# Altium schematic sheet Ethernet.SchDoc: Ethernet
size A4; DocumentNumber: MB1246; Revision: B.1; SheetNumber: 7; SheetTotal: 17; Project: STM32H7xxI-EVAL
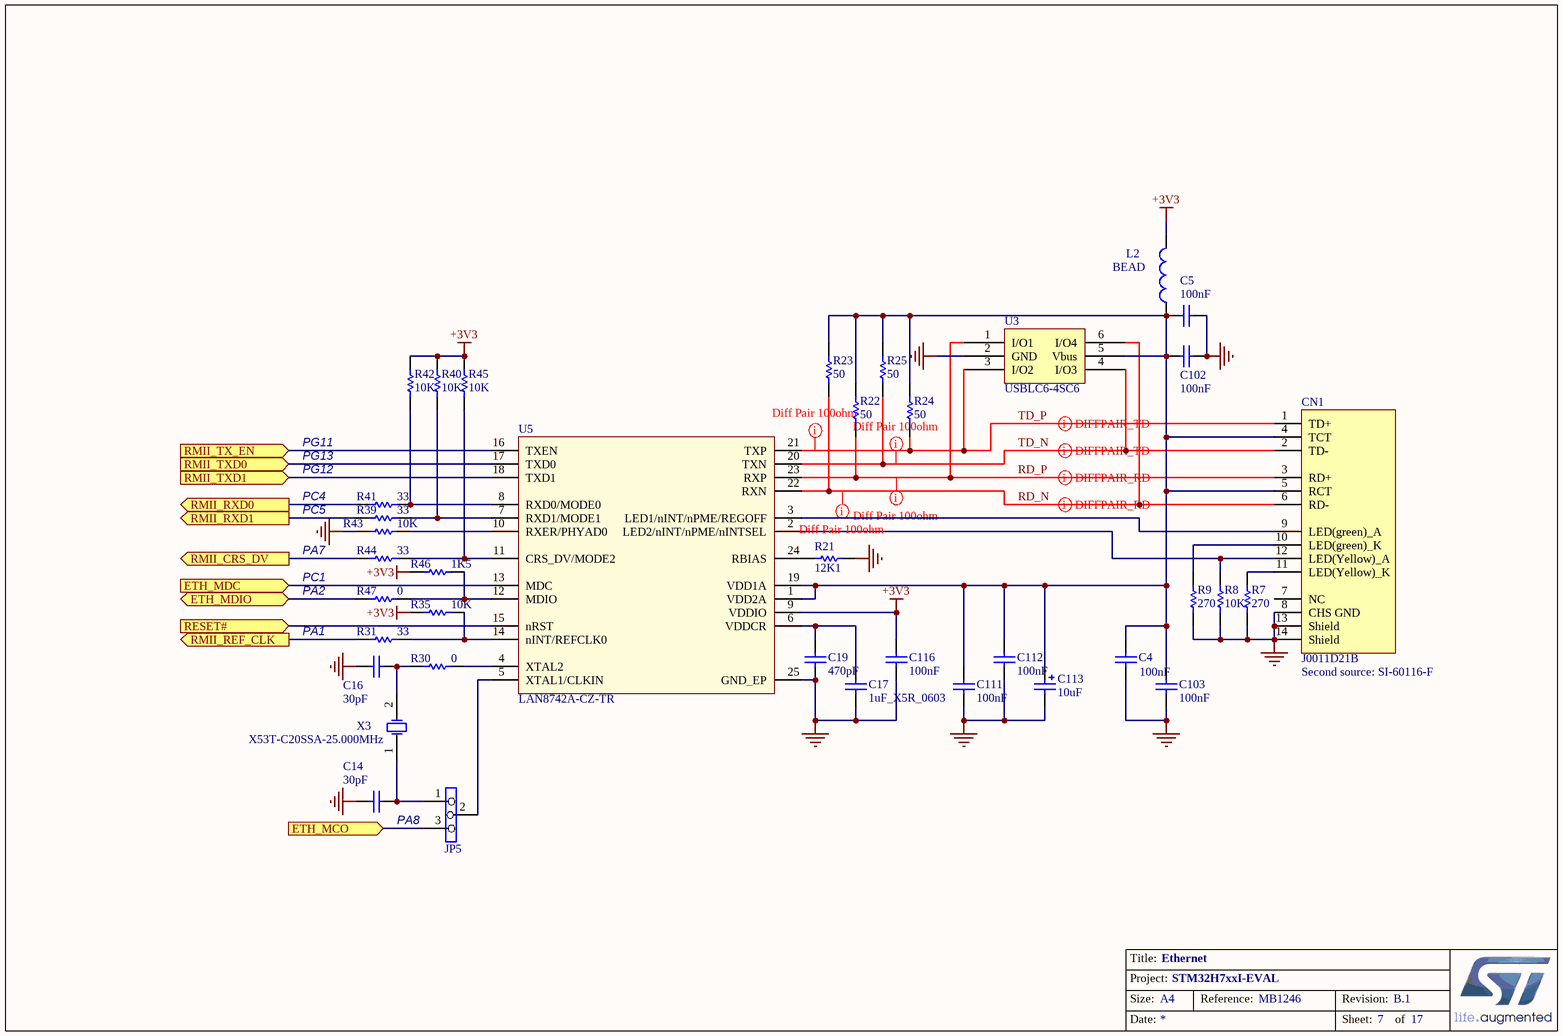
[diagram p0: Ethernet.SchDoc]

## Parts
C4  100nF  [0603C]
C5  100nF  [0603C]
C14  30pF  [0603C]
C16  30pF  [0603C]
C17  1uF_X5R_0603  [0603C]
C19  470pF  [0603C]
C102  100nF  [0603C]
C103  100nF  [0603C]
C111  100nF  [0603C]
C112  100nF  [0603C]
C113  10uF  [TAN-A]
C116  100nF  [0603C]
CN1  J0011D21B  [RJ45_J0011D01BNL]
JP5  (no value)  [SIP3]
L2  BEAD  [0603L]
R7  270  [0603R]
R8  10K  [0603R]
R9  270  [0603R]
R21  12K1  [0603R]
R22  50  [0603R]
R23  50  [0603R]
R24  50  [0603R]
R25  50  [0603R]
R30  0  [0603R]
R31  33  [0603R]
R35  10K  [0603R]
R39  33  [0603R]
R40  10K  [0603R]
R41  33  [0603R]
R42  10K  [0603R]
R43  10K  [0603R]
R44  33  [0603R]
R45  10K  [0603R]
R46  1K5  [0603R]
R47  0  [0603R]
U3  USBLC6-4SC6  [SOT23-6]
U5  LAN8742A-CZ-TR  [QFN24_0R5_4X4]
X3  X53T-C20SSA-25.000MHz  [XTAL_2SM_5X3R2]

## Ports
ETH_MCO (in), ETH_MDC (in), ETH_MDIO (bidir), RESET# (in), RMII_CRS_DV (out), RMII_REF_CLK (out), RMII_RXD0 (out), RMII_RXD1 (out), RMII_TX_EN (in), RMII_TXD0 (in), RMII_TXD1 (in)

## Nets
+3V3: C116.2 L2.2 R35.1 R40.1 R42.1 R45.1 R46.2 U5.9(VDDIO)
GND: C4.1 C5.1 C14.2 C16.2 C17.2 C19.1 C102.1 C103.1 C111.1 C112.1 C113.2 C116.1 CN1.8(CHS_GND) CN1.13(Shield) CN1.14(Shield) R7.2 R8.2 R9.2 R21.2 R43.2 U3.2(GND) U5.25(GND_EP)
ETH_MCO: JP5.3 ; port ETH_MCO
ETH_MDC: U5.13(MDC) ; port ETH_MDC
ETH_MDIO: R47.2 ; port ETH_MDIO
RD_N: CN1.6(RD-) R23.1 U3.6(I/O4) U5.22(RXN)
RD_P: CN1.3(RD+) R22.1 U3.1(I/O1) U5.23(RXP)
RESET#: U5.15(nRST) ; port RESET#
RMII_CRS_DV: R44.2 ; port RMII_CRS_DV
RMII_REF_CLK: R31.2 ; port RMII_REF_CLK
RMII_RXD0: R41.2 ; port RMII_RXD0
RMII_RXD1: R39.2 ; port RMII_RXD1
RMII_TX_EN: U5.16(TXEN) ; port RMII_TX_EN
RMII_TXD0: U5.17(TXD0) ; port RMII_TXD0
RMII_TXD1: U5.18(TXD1) ; port RMII_TXD1
TD_N: CN1.2(TD-) R25.1 U3.4(I/O3) U5.20(TXN)
TD_P: CN1.1(TD+) R24.1 U3.3(I/O2) U5.21(TXP)
NetC4_2: C4.2 C5.2 C102.2 C103.2 C111.2 C112.2 C113.1 CN1.4(TCT) CN1.5(RCT) L2.1 R22.2 R23.2 R24.2 R25.2 U3.5(Vbus) U5.1(VDD2A) U5.19(VDD1A)
NetC14_1: C14.1 JP5.1 X3.1(OSC1)
NetC16_1: C16.1 R30.2 X3.2(OSC2)
NetC17_1: C17.1 C19.2 U5.6(VDDCR)
NetCN1_9: CN1.9(LED(green)_A) U5.3(LED1/nINT/nPME/REGOFF)
NetCN1_10: CN1.10(LED(green)_K) R9.1
NetCN1_11: CN1.11(LED(Yellow)_K) R7.1
NetCN1_12: CN1.12(LED(Yellow)_A) R8.1 U5.2(LED2/nINT/nPME/nINTSEL)
NetJP5_2: JP5.2 U5.5(XTAL1/CLKIN)
NetR21_1: R21.1 U5.24(RBIAS)
NetR30_1: R30.1 U5.4(XTAL2)
NetR31_1: R31.1 R35.2 U5.14(nINT/REFCLK0)
NetR39_1: R39.1 R40.2 U5.7(RXD1/MODE1)
NetR41_1: R41.1 R42.2 U5.8(RXD0/MODE0)
NetR43_1: R43.1 U5.10(RXER/PHYAD0)
NetR44_1: R44.1 R45.2 U5.11(CRS_DV/MODE2)
NetR46_1: R46.1 R47.1 U5.12(MDIO)

Not connected (* = marked no-connect by the designer): CN1 7(NC)

## Layout directives
differential pair: RD_N, RD_P, TD_N, TD_P
rule Matched Net Lengths [Tolerance = 100mil]: RD_N, RD_P, TD_N, TD_P

## Notes on the sheet
- PG11
- PG13
- PG12
- PC4
- PC5
- PA7
- PC1
- PA2
- PA1
- (near CN1) Second source: SI-60116-F
- PA8
- Title:
- Project:
- Size:
- Date:
- A4
- Reference:
- Sheet:
- Revision:
- of

## Library data of the parts
C4 C5 C102 C103 C111 C112 C116 = Capacitor_ST: Capacitor 0402 / 0603 / 0805; Revision: July-2002: Re-released for DXP Platform.; Value: 100nF
C14 C16 C19 = Capacitor_ST: Capacitor 0402 / 0603 / 0805; Value: 100nF; Revision: July-2002: Re-released for DXP Platform.
C17 = CAP SMD 0603  X5R 1µF 25V 10%: 0603  X5R 1µF; Rated voltage: 25V; Tolerance: 10%; Manufacturer: *; Manufacturer P/N: *; Order code Farnell: 1288202RL; Value: 1µF; Power: *; Technology: X5R; Temperature  Factor: *; Temperature Max: +125°C; Temperature Min: -55°C; STS Code: *
C113 = Cap_10uF_POL_10%_TANA: Polarized Capacitor,10uF,10V,10%,typeA,VISHAY; Manuf_Part_1: 293D106X9010A2TE3; Revision: July-2002: Re-released for DXP Platform.; Value: 10uF; Manuf_1: VISHAY; Order: *; ECCN_US/EU: n/a
JP5 = Jumper3
L2 = Inductor: Value: 100uH; Published: 8-Jun-2000; Revision: July-2002: Re-released for DXP Platform.; Publisher: Altium Limited
R7 R9 = Resistor_ST: Resistor 0402 / 0603 / 0805; Description: Resistor 0402 or 0603 or 0805; Value: 10K
R8 R35 R40 R42 R43 R45 = Resistor_ST: Resistor 0402 / 0603 / 0805; Description: Resistor 0402 or 0603 or 0805; Value: 10K
R21 = Res_12K1_1%_0603: Resistor,12K1,0603,1%,VISHAY; Manuf_Part_1: MCT 0603-50 1% P5 12K1; Order: 2325243; Value: 12K1; ECCN_US/EU: n/a; Manuf_1: VISHAY; Distrib: FARNELL
R22-R25 = Res_50_1%_0603: Resistor,50,0603,1%,YAGEO; Manuf_Part_1: RC0402FR-0750RL; Description: Resistor,50,0402,1%,YAGEO; Value: 50; Manuf_1: YAGEO; Order: *; ECCN_US/EU: n/a; Distrib: FARNELL
R30 R47 = Res1: Resistor; Value: 1K; Published: 8-Jun-2000; Revision: July-2002: Re-released for DXP Platform.; Publisher: Altium Limited
R31 R39 R41 R44 = Res_33_1%_0402: Resistor,33,0402,1%,YAGEO; Manuf_Part_1: RC0402FR-0733RL; Value: 33; Manuf_1: YAGEO; Order: *; ECCN_US/EU: n/a; Distrib: FARNELL
R46 = Res_1K5_1%_0402: Resistor,1K5,0402,1%,YAGEO; Manuf_Part_1: RC0402FR-071K5L; Value: 1K5; Manuf_1: YAGEO; Order: RC0402FR-071K5L; ECCN_US/EU: n/a; Distrib: FARNELL
U5 = LAN8742A-CZ-TR: LAN8742A-CZ-TR - Small Footprint RMII 10/100 Ethernet, Transceiver with HP Auto-MDIX and flexPWR Technology SQFN-24; Manuf_1: MICROCHIP; Order: LAN8742A-CZ-TR; Manuf_Part_1: LAN8742A-CZ-TR; Distrib: MICROCHIP
X3 = XTAL_5032: Crystal Oscillator; Published: 8-Jun-2000; LatestRevisionDate: 17-Jul-2002; LatestRevisionNote: Re-released for DXP Platform.; PackageReference: R38; Publisher: Altium Limited